# Altium schematic sheet LedDuino.SchDoc
size 209 x 148 mm
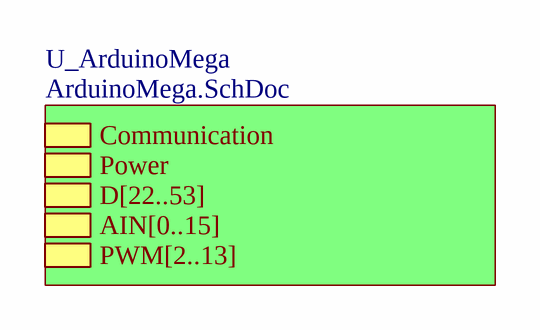
[diagram p0: LedDuino.SchDoc]

## Sub-sheets
U_ArduinoMega = ArduinoMega.SchDoc: Communication (harness Communication), Power (harness Power), D[22..53], AIN[0..15], PWM[2..13]

## Notes on the sheet
- Title:
- Doc. Name:
- Variant:
- PCB Nr.:
- Rev.:
- Date:
- Drawn by:
- Sheet:
- of